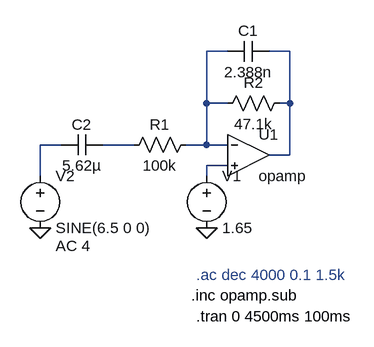
[diagram p0: schematic Simulacion.asc]
Simulacion.asc, the LTspice schematic file:
Version 4.1
SHEET 1 880 680
WIRE 112 -112 80 -112
WIRE 208 -112 176 -112
WIRE 80 -32 80 -112
WIRE 112 -32 80 -32
WIRE 208 -32 208 -112
WIRE 208 -32 192 -32
WIRE -144 32 -176 32
WIRE -32 32 -80 32
WIRE 80 32 80 -32
WIRE 80 32 48 32
WIRE 112 32 80 32
WIRE 208 48 208 -32
WIRE 208 48 176 48
WIRE 112 64 80 64
WIRE -176 80 -176 32
WIRE 80 80 80 64
FLAG 80 160 0
FLAG -176 160 0
SYMBOL OpAmps\\opamp 144 -16 R0
SYMATTR InstName U1
SYMBOL voltage 80 64 R0
WINDOW 123 0 0 Left 0
WINDOW 39 0 0 Left 0
SYMATTR InstName V1
SYMATTR Value 1.65
SYMBOL voltage -176 64 R0
WINDOW 123 24 124 Left 2
WINDOW 39 0 0 Left 0
SYMATTR InstName V2
SYMATTR Value SINE(6.5 0 0)
SYMATTR Value2 AC 4
SYMBOL res 64 16 R90
WINDOW 0 0 56 VBottom 2
WINDOW 3 32 56 VTop 2
SYMATTR InstName R1
SYMATTR Value 100k
SYMBOL res 208 -48 R90
WINDOW 0 0 56 VBottom 2
WINDOW 3 32 56 VTop 2
SYMATTR InstName R2
SYMATTR Value 47.1k
SYMBOL cap 176 -128 R90
WINDOW 0 0 32 VBottom 2
WINDOW 3 32 32 VTop 2
SYMATTR InstName C1
SYMATTR Value 2.388n
SYMBOL cap -80 16 R90
WINDOW 0 0 32 VBottom 2
WINDOW 3 32 32 VTop 2
SYMATTR InstName C2
SYMATTR Value 5.62µ
TEXT 56 264 Left 2 !.inc opamp.sub
TEXT 64 232 Left 2 ;.ac dec 4000 0.1 1.5k
TEXT 64 296 Left 2 !.tran 0 4500ms 100ms

The netlist it stands for:
* Simulacion.asc
X§U1 N001 N005 N002 opamp Aol=100K GBW=10Meg  ; pins invin noninvin out
V1 N005 0 1.65
V2 N003 0 SINE(6.5 0 0) AC 4
R1 N001 N004 100k
R2 N002 N001 47.1k
C1 N002 N001 2.388n
C2 N004 N003 5.62µ
.inc opamp.sub
* .ac dec 4000 0.1 1.5k
.tran 0 4500ms 100ms
.backanno
.end